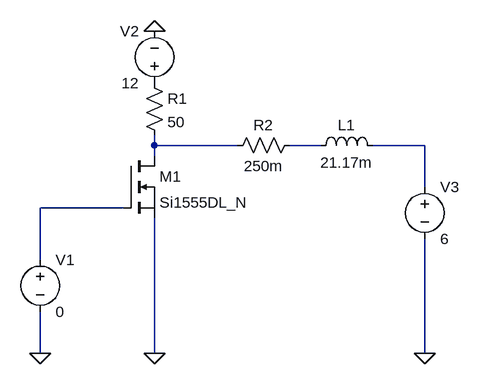
[diagram p0: schematic Draft3.asc]
Draft3.asc, the LTspice schematic file:
Version 4
SHEET 1 880 680
WIRE -272 -192 -272 -208
WIRE -144 -192 -272 -192
WIRE -16 -192 -64 -192
WIRE 144 -192 64 -192
WIRE -272 -176 -272 -192
WIRE 144 -128 144 -192
WIRE -320 -96 -448 -96
WIRE -448 -16 -448 -96
WIRE -448 128 -448 64
WIRE -272 128 -272 -80
WIRE 144 128 144 -48
FLAG -448 128 0
FLAG -272 128 0
FLAG -272 -368 0
FLAG 144 128 0
SYMBOL voltage -448 -32 R0
WINDOW 123 0 0 Left 2
WINDOW 39 0 0 Left 2
SYMATTR InstName V1
SYMATTR Value 0
SYMBOL res -288 -304 R0
SYMATTR InstName R1
SYMATTR Value 50
SYMBOL nmos -320 -176 R0
SYMATTR InstName M1
SYMATTR Value Si1555DL_N
SYMBOL voltage -272 -272 R180
WINDOW 0 24 96 Left 2
WINDOW 3 24 16 Left 2
WINDOW 123 0 0 Left 2
WINDOW 39 0 0 Left 2
SYMATTR InstName V2
SYMATTR Value 12
SYMBOL res -160 -176 R270
WINDOW 0 32 56 VTop 2
WINDOW 3 0 56 VBottom 2
SYMATTR InstName R2
SYMATTR Value 250m
SYMBOL ind -32 -176 R270
WINDOW 0 32 56 VTop 2
WINDOW 3 5 56 VBottom 2
SYMATTR InstName L1
SYMATTR Value 21.17m
SYMBOL voltage 144 -144 R0
WINDOW 123 0 0 Left 2
WINDOW 39 0 0 Left 2
SYMATTR InstName V3
SYMATTR Value 6

The netlist it stands for:
* Draft3.asc
V1 N004 0 0
R1 P001 N001 50
M1 N001 N004 0 0 Si1555DL_N
V2 P001 0 12
R2 N001 N002 250m
L1 N002 N003 21.17m
V3 N003 0 6
.model NMOS NMOS
.model PMOS PMOS
.lib standard.mos
.backanno
.end